# EasyEDA schematic SCH_NFC通信_2021-12-08.json
TITLE: Sheet_1; REV: 1.0; Date: 2021-12-01; Sheet: 1/1; Drawn By: spzyh; Company: Your Company
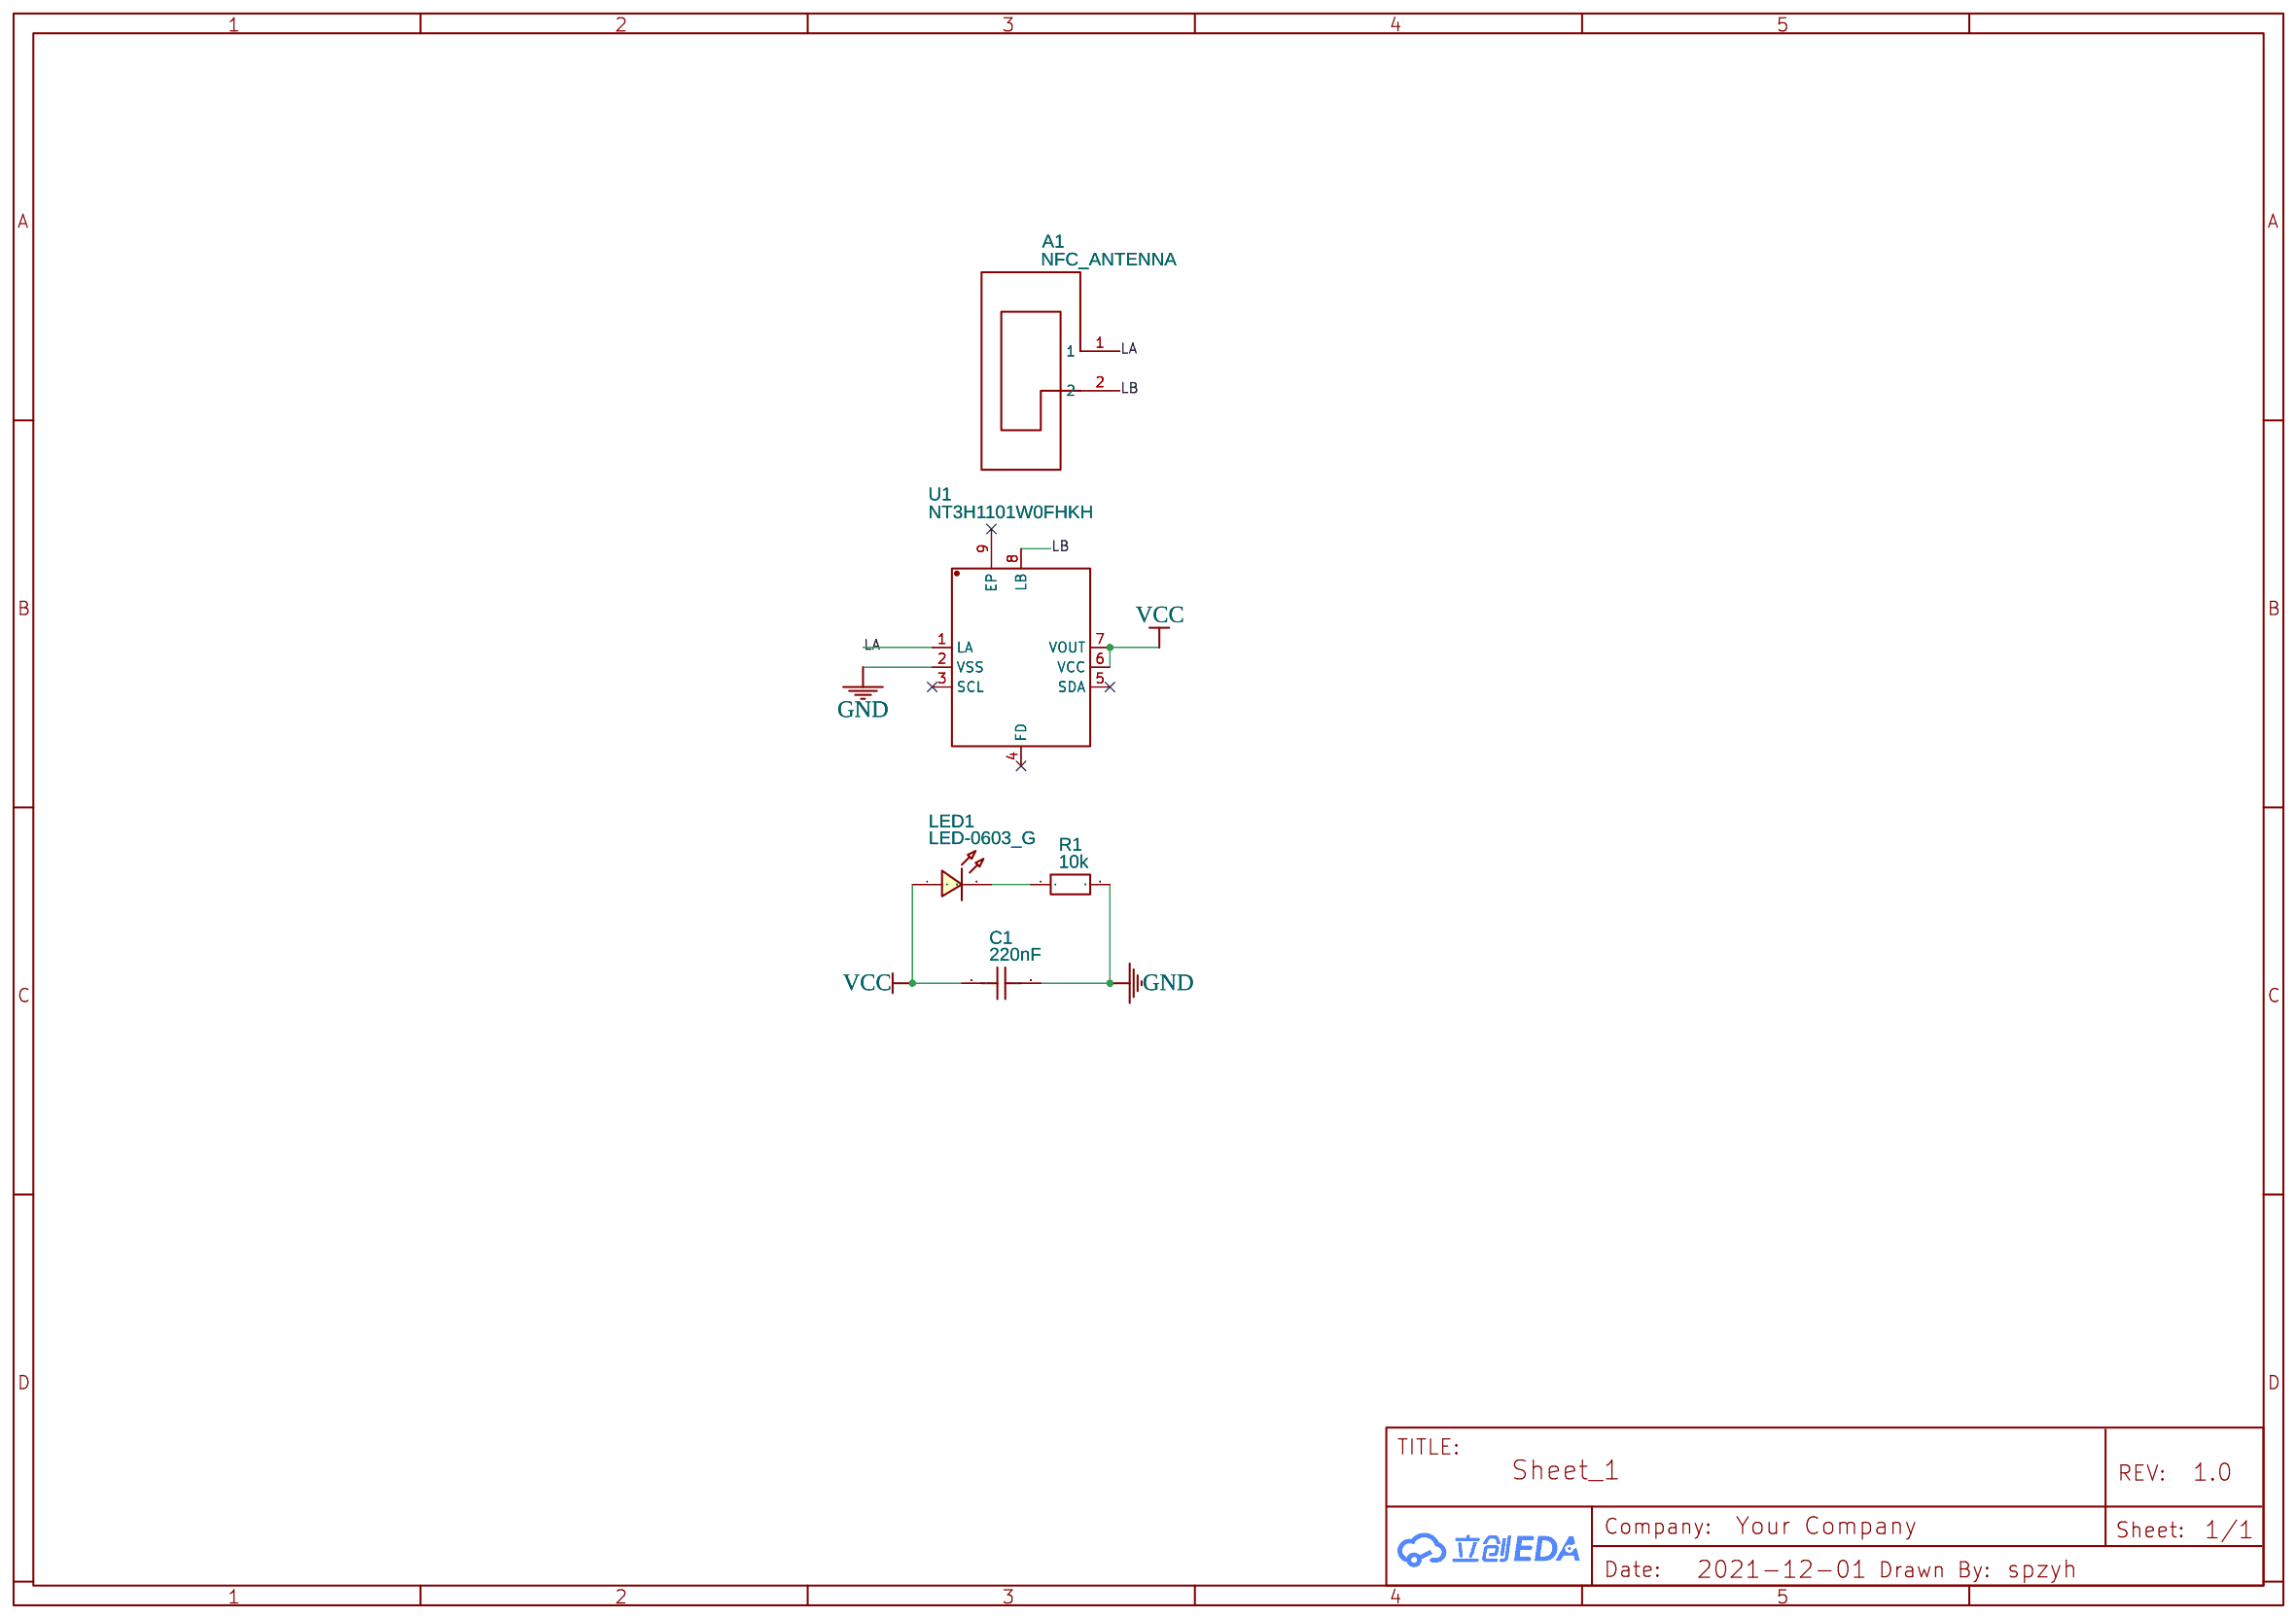
[diagram p0: schematic sheet]

## Parts
A1  NFC_ANTENNA  [NFC天线]
C1  220nF  [C0603]
LED1  LED-0603_G  [LED0603_GREEN]
R1  10k  [R0603]
U1  NT3H1101W0FHKH  [XQFN-8_L1.6-W1.6-P0.50-BR]

## Library data of the parts
A1 = NFC_ANTENNA: Supplier: Z; Contributor: scarrr0725
C1 = C_0603_US: Contributor: LCEDA_Lib
LED1 = LED-0603_G: Manufacturer: EVERLIGHT(台湾亿光); Manufacturer Part: 19-217/GHC-YR1S2/3T; Supplier Part: C72043; Supplier: LCSC; Contributor: LCEDA_Lib
R1 = R_0603_EU: Contributor: LCEDA_Lib
U1 = NT3H1101W0FHKH: Supplier: LCSC; Supplier Part: C73156; Manufacturer: NXP Semicon; Contributor: LCSC; JLCPCB Part Class: Extended Part

## Nets
GND: C1.2 R1.2 U1.2(VSS)
VCC: C1.1 LED1.1 U1.6(VCC) U1.7(VOUT)
LA: A1.1 U1.1(LA)
LB: A1.2 U1.8(LB)
Net-(LED1-2): LED1.2 R1.1

Not connected (* = marked no-connect by the designer): U1 3(SCL)* 4(FD)* 5(SDA)* 9(EP)*
